# EAGLE design Jebao (EAGLE 6.1)
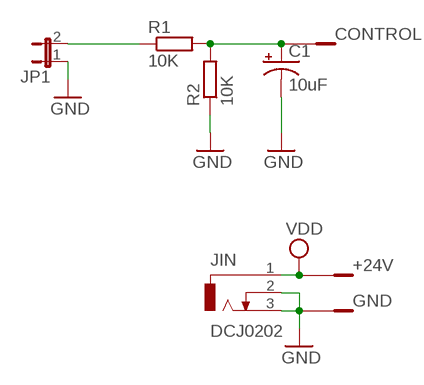
[diagram p0: schematic, sheet 1]

## Parts
+24V  POWERPIN  [POWERPIN]
C1  10uF  CPOL-USA/3216-18R  [A/3216-18R]
CONTROL  POWERPIN  [POWERPIN]
GND  POWERPIN  [POWERPIN]
JIN  DCJ0202  [DCJ0202]
JP1  JP1E  [JP1]
R1  10K  R-EU_R0805  [R0805]
R2  10K  R-EU_R0805  [R0805]

## Nets
12V [12V]: +24V.1 JIN.1 ; supply symbol labelled VDD
GND [gnd]: C1.- GND.1 JIN.2 JIN.3 JP1.1 R2.1
N$1: JP1.2 R1.1
N$2: C1.+ CONTROL.1 R1.2 R2.2

## Library data of the parts
+24V CONTROL GND = PowerPin:POWERPIN
C1 = adafruit:CPOL-US: POLARIZED CAPACITOR, American symbol
JIN = con-jack:DCJ0202: DC POWER JACK Source: DCJ0202.pdf; OC_FARNELL: unknown; OC_NEWARK: unknown
JP1 = jumper:JP1E: JUMPER
R1 R2 = rcl:R-EU_: RESISTOR, European symbol

## Net classes
2 gnd: width 0.305 mm, drill 0.305 mm, clearance 0.203 mm
3 12V: width 1.016 mm, drill 0.305 mm, clearance 0.254 mm

## Board
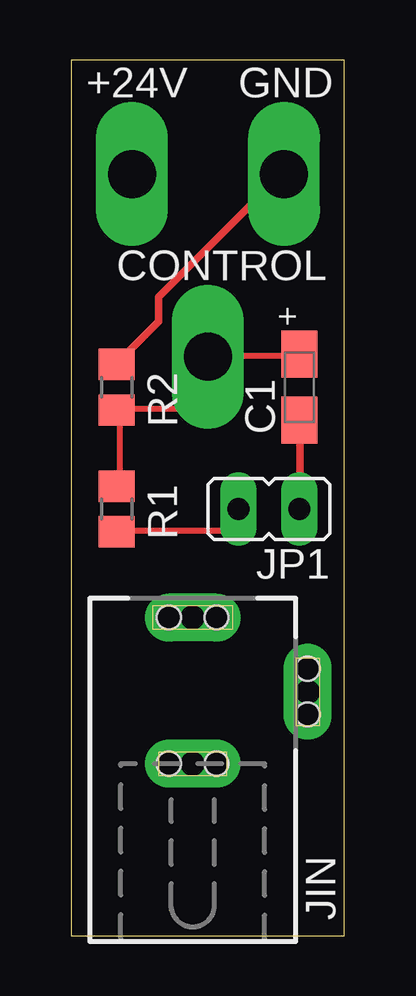
[diagram p1: board, top side]
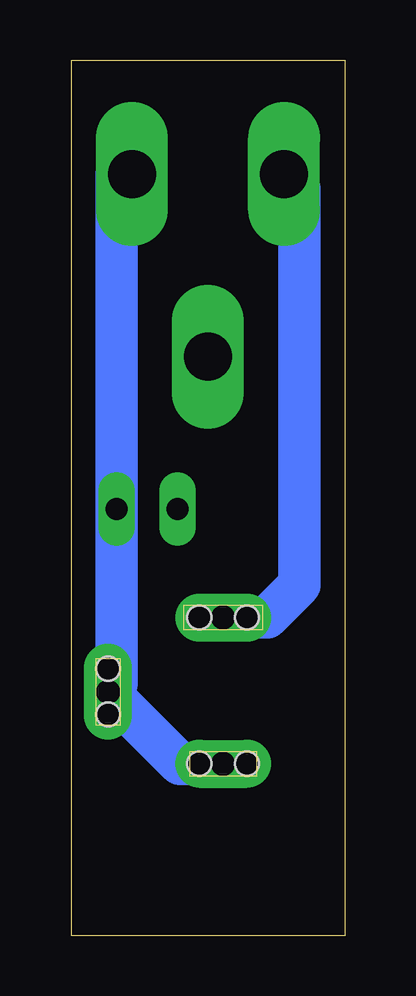
[diagram p2: board, bottom side, seen from below]

Size 11.41 x 36.5 mm. Coordinates in mm from the lower left corner, seen from the top.
Outline: 0,0 11.41,0 11.41,36.5 0,36.5 0,0
Copper layers (1*16): Top 0.035mm / dielectric 1.5mm / Bottom 0.035mm
Design rules: minimum track width 8mil, minimum drill 20mil, track to track 8mil, track to pad 8mil, pad to pad 8mil, via to via 8mil, smd to smd 8mil, copper to edge 10mil, drill to drill 8mil, minimum pad ring 12mil, minimum via ring 10mil, stop-mask expansion 4mil, vias tented up to drill 25mil, thermal gap 10mil

### Footprints (pad centres in the part's own frame; a part is rotated, then mirrored left to right if it is on the bottom)
POWERPIN = drill 2 long: 1 0,0
A/3216-18R = smd 1.95 x 1.5: + 1.375,0; - -1.375,0
DCJ0202 = drill 1 pad 2 long: 1 0,3.1; 2 4.8,0; 3 0,-3 | hole 1: 0.991,-2.997; -0.991,-2.997; 4.801,-0.94; 4.801,0.965; 0.991,3.099; -0.991,3.099
JP1 = drill 0.914 long: 1 0,-1.27; 2 0,1.27
R0805 = smd 1.3 x 1.5: 1 -0.95,0; 2 0.95,0

### Placement (x,y rotation side)
+24V  2.54,31.75 90 top
C1  9.53,22.86 90 top
CONTROL  5.71,24.13 90 top
GND  8.89,31.75 90 top
JIN  5.08,10.16 0 top
JP1  8.26,17.78 90 top
R1  1.91,17.78 90 top
R2  1.91,22.86 270 top

### Tracks (layer width: path | path; a pad name or v marks a point on that pad's centre or on a via)
12V
  Bottom 1.778: JIN.1 3.25,13.26 1.91,14.61 1.91,31.11 +24V.1
GND
  Top 0.305: R2.1 2.03,23.98 3.66,25.6 3.66,26.62 8.74,31.7 GND.1 | C1.- 9.55,21.34 9.55,17.88 JP1.1
  Bottom 1.778: JIN.3 6.88,7.16 JIN.2 9.53,10.52 JP1.1 9.53,31.75 GND.1
N$1
  Top 0.254: R1.1 2.03,16.87 6.91,16.87 6.91,17.68 JP1.2
N$2
  Top 0.254: R1.2 2.03,18.9 2.03,21.74 R2.2 2.03,21.95 5.69,21.95 5.69,23.98 CONTROL.1 5.89,24.18 9.35,24.18 C1.+